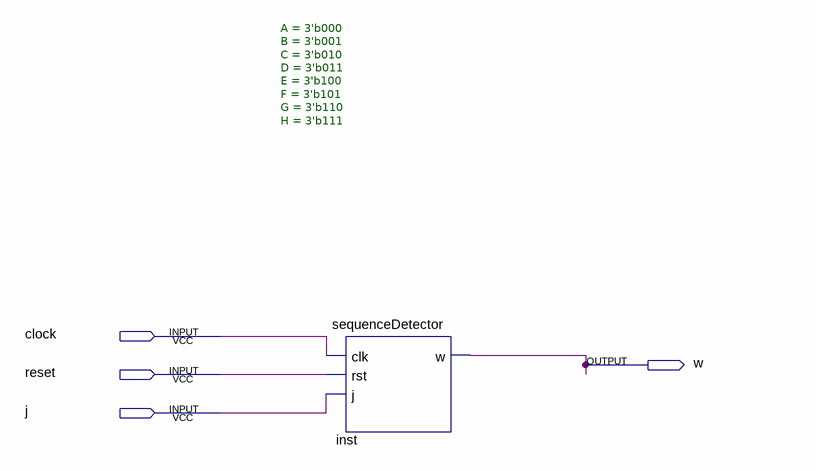
[diagram p0: schematic sheet]
// Quartus schematic sequenceDetectorBlock.bdf as structural Verilog: 1 symbols, 4 pins
module sequenceDetectorBlock (
  input  clock,
  input  reset,
  input  j,
  output w
);

  sequenceDetector #(.A(3'b000), .B(3'b001), .C(3'b010), .D(3'b011), .E(3'b100), .F(3'b101), .G(3'b110), .H(3'b111)) inst (
    .clk(clock), .rst(reset), .j(j), .w(w));
endmodule
